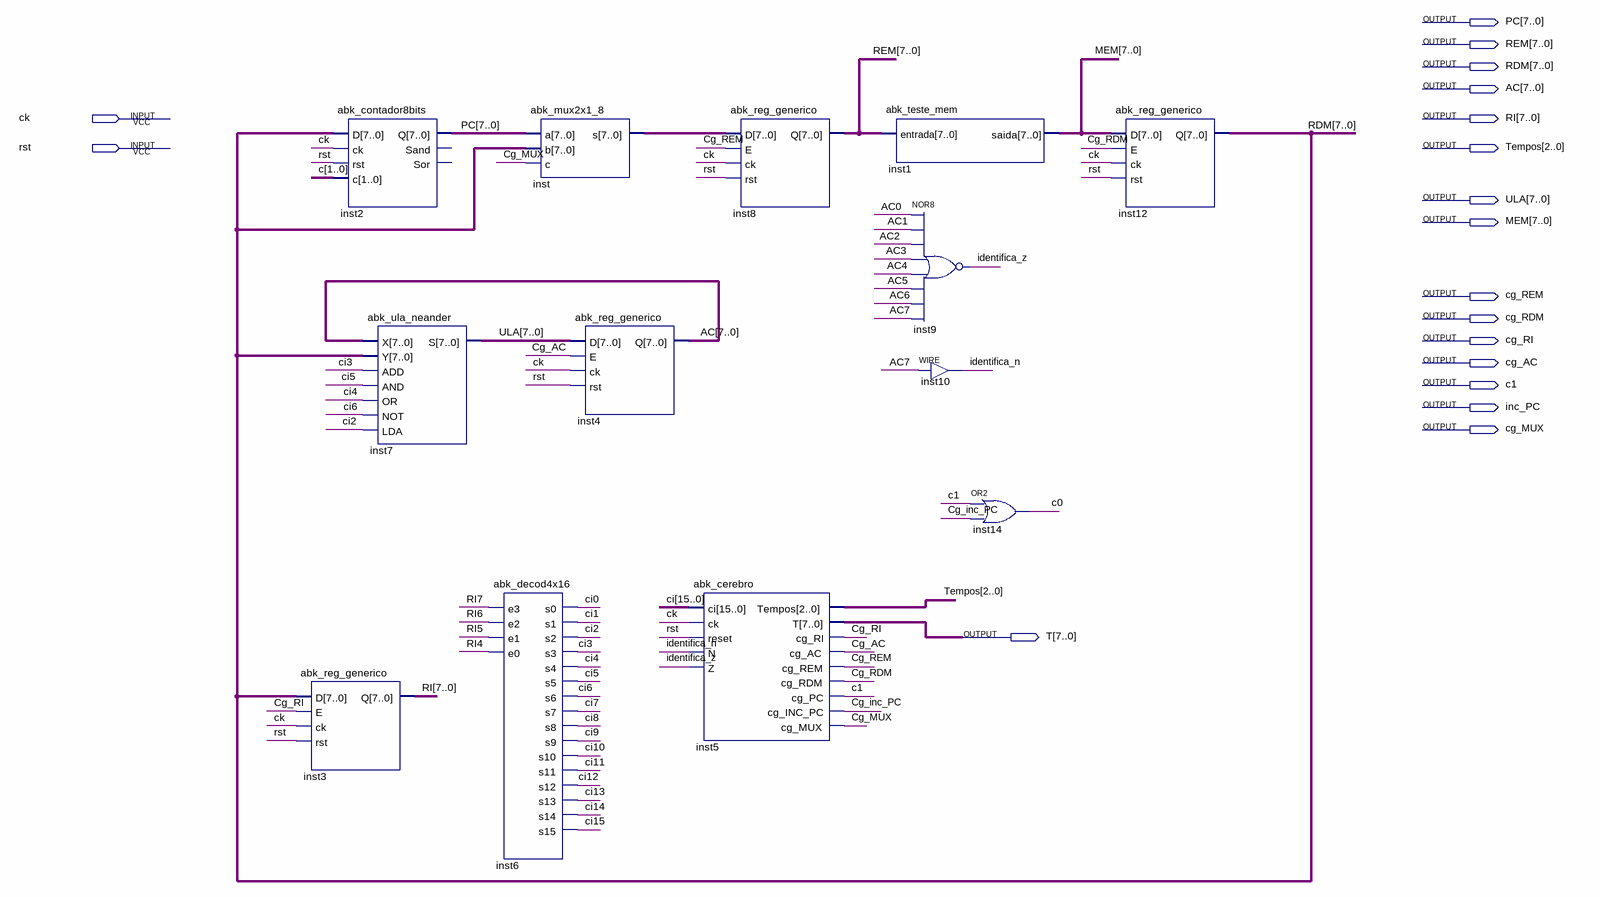
[diagram p0: schematic sheet]
// Quartus schematic abk_final.bdf as structural Verilog: 13 symbols, 18 pins
module abk_final (
  input  ck,
  input  rst,
  output [7:0] PC,
  output [7:0] REM,
  output [7:0] RDM,
  output [7:0] AC,
  output [7:0] RI,
  output [2:0] Tempos,
  output [7:0] ULA,
  output [7:0] MEM,
  output cg_REM,
  output cg_RDM,
  output cg_RI,
  output cg_AC,
  output c1,
  output inc_PC,
  output cg_MUX,
  output [7:0] T
);

  wire Cg_inc_PC, identifica_n, identifica_z;
  wire [0:0] c;
  wire [7:0] inst_s;
  wire [15:0] ci;

  abk_contador8bits inst2 (.D(RDM), .ck(ck), .rst(rst), .c({c1, c[0]}), .Q(PC));  // open: Sand, Sor
  abk_reg_generico inst3 (.D(RDM), .E(cg_RI), .ck(ck), .rst(rst), .Q(RI));
  abk_ula_neander inst7 (.X(AC), .Y(RDM), .ADD(ci[3]), .AND(ci[5]), .OR(ci[4]), .NOT(ci[6]), .LDA(ci[2]), .S(ULA));
  abk_mux2x1_8 inst (.a(PC), .b(RDM), .c(cg_MUX), .s(inst_s));
  abk_decod4x16 inst6 (
    .e3(RI[7]), .e2(RI[6]), .e1(RI[5]), .e0(RI[4]), .s0(ci[0]), .s1(ci[1]), .s2(ci[2]), .s3(ci[3]),
    .s4(ci[4]), .s5(ci[5]), .s6(ci[6]), .s7(ci[7]), .s8(ci[8]), .s9(ci[9]), .s10(ci[10]), .s11(ci[11]),
    .s12(ci[12]), .s13(ci[13]), .s14(ci[14]), .s15(ci[15]));
  abk_reg_generico inst4 (.D(ULA), .E(cg_AC), .ck(ck), .rst(rst), .Q(AC));
  abk_cerebro inst5 (
    .ci(ci), .ck(ck), .reset(rst), .N(identifica_n), .Z(identifica_z), .Tempos(Tempos), .T(T), .cg_RI(cg_RI),
    .cg_AC(cg_AC), .cg_REM(cg_REM), .cg_RDM(cg_RDM), .cg_PC(c1), .cg_INC_PC(Cg_inc_PC), .cg_MUX(cg_MUX));
  abk_reg_generico inst8 (.D(inst_s), .E(cg_REM), .ck(ck), .rst(rst), .Q(REM));
  abk_teste_mem inst1 (.entrada(REM), .saida(MEM));
  nor inst9 (identifica_z, AC[0], AC[1], AC[2], AC[3], AC[4], AC[5], AC[6], AC[7]);
  assign identifica_n = AC[7];  // WIRE inst10
  or inst14 (c[0], c1, Cg_inc_PC);
  abk_reg_generico inst12 (.D(MEM), .E(cg_RDM), .ck(ck), .rst(rst), .Q(RDM));
endmodule
